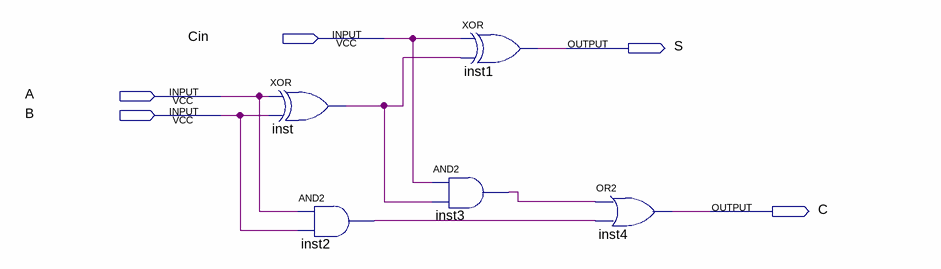
[diagram p0: schematic sheet]
// Quartus schematic somador_1bit.bdf as structural Verilog: 5 symbols, 5 pins
module somador_1bit (
  input  Cin,
  input  A,
  input  B,
  output S,
  output C
);

  wire inst2_out, inst3_out, inst_out;

  xor inst (inst_out, A, B);
  and inst2 (inst2_out, A, B);
  and inst3 (inst3_out, Cin, inst_out);
  xor inst1 (S, Cin, inst_out);
  or inst4 (C, inst3_out, inst2_out);
endmodule
